# EAGLE design dcdc_0421 (EAGLE 9.6.2)
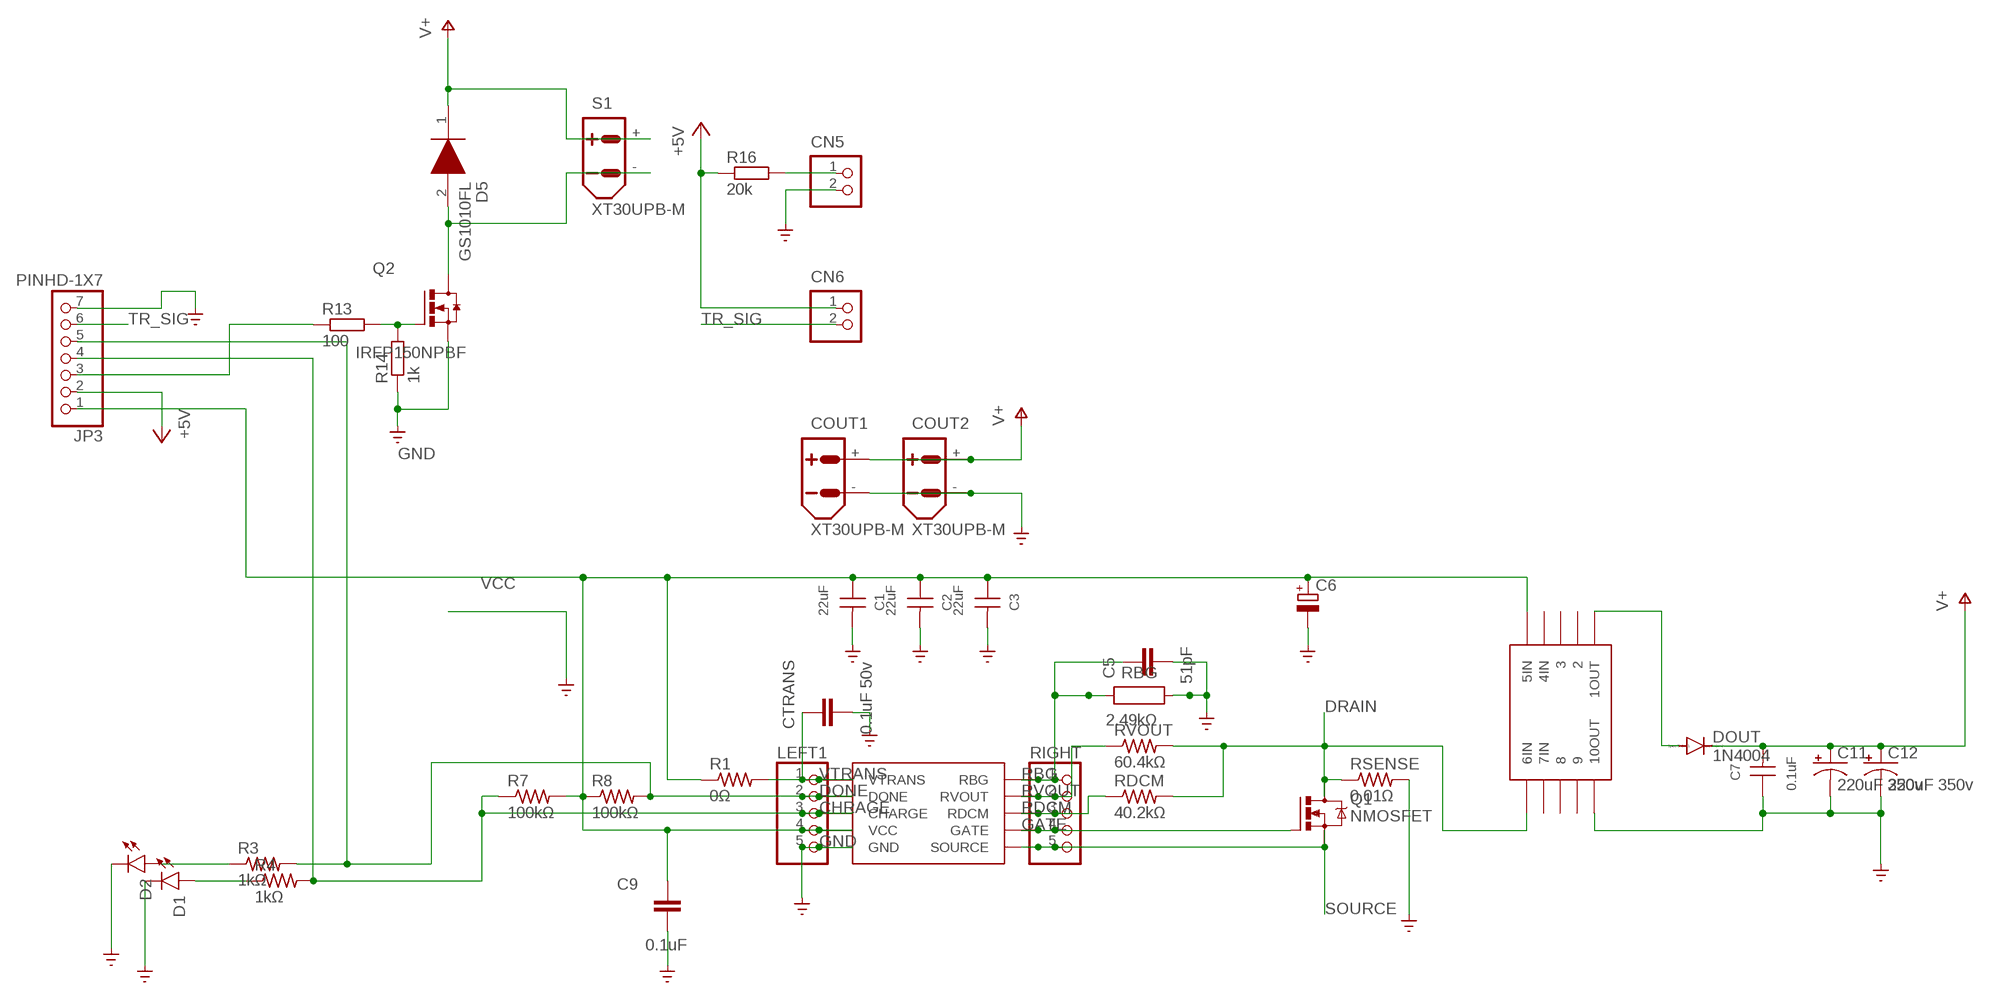
[diagram p0: schematic, sheet 1]

## Parts
C1  22uF  WCAP-CSGP_1210_H0.95_885012009002_25V(DC)  [WCAP-CSGP_1210_H0.95]
C2  22uF  WCAP-CSGP_1210_H0.95_885012009002_25V(DC)  [WCAP-CSGP_1210_H0.95]
C3  22uF  WCAP-CSGP_1210_H0.95_885012009002_25V(DC)  [WCAP-CSGP_1210_H0.95]
C5  51pF  C0603C100C5GACTU  [CAP_0603]
C6  CPOL-EUTT2D6  [TT2D6]
C7  0.1uF  WCAP-CSGP_1812_H1.25_885012010001_16V(DC)  [WCAP-CSGP_1812_H1.25]
C9  0.1uF  C0603C100C5GACTU  [CAP_0603]
C11  220uF 350v  CAPACITOR-PE7.5-18  [E7,5-18]
C12  220uF 350v  CAPACITOR-PE7.5-18  [E7,5-18]
CN5  S2B-XH-A  [S2B-XH-A]
CN6  S2B-XH-A  [S2B-XH-A]
COUT1  XT30UPB-M  [XT30UPB-M]
COUT2  XT30UPB-M  [XT30UPB-M]
CTRANS  0.1uF 50v  GRM31CR60J107ME39L  [CAP_1206]
D1  LED_RADIALWHITE  [LEDRD254W60D565H860B_W]
D2  LED_RADIALWHITE  [LEDRD254W60D565H860B_W]
D5  GS1010FL  [SODFL3618X110N]
DOUT  1N4004  [DO41-10]
JP3  PINHD-1X7  [1X07]
LEFT1  PINHD-1X5  [1X05]
Q1  NMOSFET  NMOSFET__TO220  [TO220BV]
Q2  IRFP150NPBF  [TO-247AC]
R1  0Ω  R-US_M2012  [M2012]
R3  1kΩ  RC0402JR-070RL  [RES_0402]
R4  1kΩ  RC0402JR-070RL  [RES_0402]
R7  100kΩ  R-US_R1210  [R1210]
R8  100kΩ  R-US_R1210  [R1210]
R13  100  R-EU_R0603  [R0603]
R14  1k  R-EU_R0603  [R0603]
R16  20k  R-EU_R0603  [R0603]
RBG  2.49kΩ  WRIS-PSMC_2512_580070763005_6.3X3.1X0.51X1.1  [WRIS_PSMC_2512_6.3X3.1X0.51X1.1(LXWXHXPW)]
RDCM  40.2kΩ  CRCW08050000Z0EA  [RES_0805]
RIGHT  PINHD-1X5  [1X05]
RSENSE  0.01Ω  WSLP1206R0500FEA  [RES_1206]
RVOUT  60.4kΩ  CRCW08050000Z0EA  [RES_0805]
S1  XT30UPB-M  [XT30UPB-M]
U$1  LT3750_2  [LT3750_2]
U$2  32052  [32052]

## Nets
2 [New Class]: D5.2(A) Q2.D S1.-
+5V [New Class]: CN6.1 JP3.2 R16.1
CHRAGE: JP3.4 LEFT1.3 R4.2 R7.1 U$1.CHARGE
DONE: JP3.5 LEFT1.2 R3.2 R8.2 U$1.DONE
DRAIN [New Class]: Q1.D RDCM.2 RSENSE.1 RVOUT.2 U$2.6IN
GATE: Q1.G RIGHT.4 U$1.GATE
GND: C1.2 C2.2 C3.2 C5.2 C6.- C7.1 C9.2 C11.- C12.- CN5.2 COUT1.- COUT2.- CTRANS.2 D1.C D2.C JP3.7 LEFT1.5 Q2.S R14.1 RBG.2 RSENSE.2 U$1.GND U$2.10OUT ; supply symbol labelled SUPPLY0_GND_
N$1 [New Class]: JP3.3 R13.1
N$7 [New Class]: DOUT.A U$2.1OUT
N$11 [New Class]: D1.A R4.1
N$15 [New Class]: D2.A R3.1
N$21 [New Class]: Q2.G R13.2 R14.2
N$22 [New Class]: CN5.1 R16.2
RBG: C5.1 RBG.1 RIGHT.1 U$1.RBG
RDCM: RDCM.1 RIGHT.3 U$1.RDCM
RVOUT: RIGHT.2 RVOUT.1 U$1.RVOUT
SOURCE: Q1.S RIGHT.5 U$1.SOURCE
TR_SIG [New Class]: CN6.2 JP3.6
V+ [New Class]: C7.2 C11.+ C12.+ COUT1.+ COUT2.+ D5.1(K) DOUT.C S1.+
VCC: C1.1 C2.1 C3.1 C6.+ C9.1 JP3.1 LEFT1.4 R1.1 R7.2 R8.1 U$1.VCC U$2.5IN
VTRANS: CTRANS.1 LEFT1.1 R1.2 U$1.VTRANS
Unconnected: U$2.2 U$2.3 U$2.4IN U$2.7IN U$2.8 U$2.9

## Library data of the parts
C1-C3 = Wurth_Capacitors_WCAP-CSGP:WCAP-CSGP_1210_H0.95: WCAP-CSGP MLCCs 1210 Characteristics General purpose product series High performance ceramic High electrical precision and stability ceramic especially for NP0 Minimal aging especially for NP0 Mounting style: SMT-Chip Ceramic: NP0 (Class I), X5R (Class II), X7R (Class II) Temperature coefficient: ±30 ppm/°C; ±0.54 % for NP0 ±15 % for X5R and X7R Operating temperature: -55 °C up to + 125 °C for NP0 and X7R -55 °C up to + 85 °C for X5R Termination: Cu/Ni/Sn Recommended soldering: Reflow soldering Wave soldering for size 0603 Wave soldering for size 0805 (only valid for the thickness ≤0.85 mm) Applications Temperature compensation (NP0) Coupling Decoupling Bypass Smoothing Filtering Resonant circuit <https://www.we-online.com/catalog/media/o177837v209%20MLCC_GRP_all.jpg> Details see: https://www.we-online.com/catalog/en/pbs/capacitors/multilayer_ceramic_chip_capacitors/mlcc_general_purpose Updated by yingchun,Shan;2020-03-09 2020(C) Würth Elektronik; CERAMIC-TYPE: NP0 Class I; DATASHEET-URL: https://www.we-online.com/redexpert/spec/885012009002?ae; DF: -; HEIGHT: 0.95mm; MOUNT: SMT; OPERATING-TEMPERATURE: -55 up to +125 °C; PART-NUMBER: 885012009002; QMIN: 1000; RISO: 10GOhm; SIZE: 1210; TECHNICAL-REFERENCE: NP01210102J025DFCT10000; VALUE: 1nF; VR: 25V(DC)
C5 C9 = Resistor_Capacitor:C0603C100C5GACTU: CAP CER 10PF 50V C0G/NP0 0603 Manufacturer's datasheet <https://content.kemet.com/datasheets/KEM_C1003_C0G_SMD.pdf>; CREATED_BY: PCBLayout.com; DIGIKEY_PART_NUMBER: 399-7814-2-ND; MANUFACTURER: KEMET; MPN: C0603C100C5GACTU; PACKAGE: SMD 0603
C6 = rcl:CPOL-EU: POLARIZED CAPACITOR, European symbol; SPICEPREFIX: C
C7 = Wurth_Capacitors_WCAP-CSGP:WCAP-CSGP_1812_H1.25: WCAP-CSGP MLCCs 1812 Characteristics General purpose product series High performance ceramic High electrical precision and stability ceramic especially for NP0 Minimal aging especially for NP0 Mounting style: SMT-Chip Ceramic: NP0 (Class I), X5R (Class II), X7R (Class II) Temperature coefficient: ±30 ppm/°C; ±0.54 % for NP0 ±15 % for X5R and X7R Operating temperature: -55 °C up to + 125 °C for NP0 and X7R -55 °C up to + 85 °C for X5R Termination: Cu/Ni/Sn Recommended soldering: Reflow soldering Wave soldering for size 0603 Wave soldering for size 0805 (only valid for the thickness ≤0.85 mm) Applications Temperature compensation (NP0) Coupling Decoupling Bypass Smoothing Filtering Resonant circuit <https://www.we-online.com/catalog/media/o177837v209%20MLCC_GRP_all.jpg> Details see: https://www.we-online.com/catalog/en/pbs/capacitors/multilayer_ceramic_chip_capacitors/mlcc_general_purpose Updated by yingchun,Shan;2020-03-09 2020(C) Würth Elektronik; CERAMIC-TYPE: NP0 Class I; DATASHEET-URL: https://www.we-online.com/redexpert/spec/885012010001?ae; DF: -; HEIGHT: 1.25mm; MOUNT: SMT; OPERATING-TEMPERATURE: -55 up to +125 °C; PART-NUMBER: 885012010001; QMIN: 1000; RISO: 10GOhm; SIZE: 1812; TECHNICAL-REFERENCE: NP01812102J016DFCT10000; VALUE: 1nF; VR: 16V(DC)
C11 C12 = BeagleBone_Blue_R3:CAPACITOR-P: POLARIZED CAPACITOR, American symbol
CN5 CN6 = jst-xh:S2B-XH-A: Wire-to-Board 2.5mm pitch side mount connector Source: http://www.jst-mfg.com/product/pdf/jpn/XH.pdf http://www.jst-mfg.com/product/detail.php?series=277
COUT1 COUT2 S1 = amass:XT30: AMASS XT30 connector Store in Japan AMASS XT30 connector <https://szc.jp/ams-xt30>
CTRANS = Resistor_Capacitor:GRM31CR60J107ME39L: CAP CER 100UF 6.3V X5R 1206 Manufacturer's datasheet <https://www.murata.com/~/media/webrenewal/support/library/catalog/products/capacitor/mlcc/c02e.ashx?la=en-us>; CREATED_BY: PCBLayout.com; DIGIKEY_PART_NUMBER: GRM31CR60J107ME39L; MANUFACTURER: Murata Electronics North America; MPN: GRM31CR60J107ME39L; PACKAGE: SMD 1206
D1 D2 = Opto-Electronic:LED_RADIAL: LED - Generic
D5 = GS1010FL:GS1010FL: Surface general purpose rectifier Source: Datasheet; DESCRIPTION: Surface general purpose rectifier; HEIGHT: 1.1mm; MANUFACTURER_NAME: PANJIT; MANUFACTURER_PART_NUMBER: GS1010FL
DOUT = diode:1N4004: DIODE general purpose rectifier, 1 A
JP3 = Connector:PINHD-1X7: PIN HEADER; CATEGORY: CONNECTOR; SUB-CATEGORY: PIN-HEADER
LEFT1 RIGHT = Connector:PINHD-1X5: PIN HEADER; CATEGORY: CONNECTOR; SUB-CATEGORY: PIN-HEADER
Q1 = Tinkercad:NMOSFET: N-Channel MOSFET - Generic; CATEGORY: Transistor; SUB-CATEGORY: MOSFET; TYPE: N-Channel
Q2 = Transistor:IRFP150NPBF: MOSFET N-CH 100V 42A TO247AC Manufacturer's datasheet <https://www.infineon.com/dgdl/irfp150npbf.pdf?fileId=5546d462533600a4015356286d121fd6>; CREATED_BY: PCBLayout.com; DIGIKEY_PART_NUMBER: IRFP150NPBF-ND; MANUFATURER: Infineon Technologies; MPN: IRFP150NPBF; PACKAGE: TO-247AC
R1 R7 R8 = BeagleBone_Black_Wireless:R-US_: RESISTOR, American symbol
R3 R4 = Resistor_Capacitor:RC0402JR-070RL: RES SMD 0 OHM JUMPER 1/16W 0402 Manufacturer's datasheet <http://www.yageo.com/documents/recent/PYu-RC_Group_51_RoHS_L_10.pdf>; CREATED_BY: PCBLayout.com; DIGIKEY_PART_NUMBER: 311-0.0JRTR-ND; MANUFACTURER: Yageo; MPN: RC0402JR-070RL; PACKAGE: SMD 0402
R13 R14 R16 = rcl:R-EU_: RESISTOR, European symbol; SPICEPREFIX: R
RBG = Wurth_Resistor_WRIS-PSMC:WRIS-PSMC_2512: WRIS-PSMC Metal Plate Resistors High Power Current Sensing Characteristics Product series for high power current sensing up to 2 W Mounting style: SMT-Chip (standard terminal) Resistance range: 2 mΩ ‒ 10 mΩ Resistance tolerance: ±1%; ±5% Rated Power: 2 W TCR: ±100 ppm/°C Operating temperature: -55°C up to +155°C Size: 2512 Recommended soldering: Reflow soldering Applications Ignition coil & igniter Motor control Inverter Battery pack Package name and Variant abbreviation: L X W X H X PW =Length X Width X Height X Pad Width <https://katalog.we-online.com/media/images/v2/o135744v209%20Family_WRIS-PSMC.jpg> Details see: https://katalog.we-online.com/en/pbs/WRIS-PSMC Created by Ella Wu 2019-09-05 2019(C) Wurth Elektronik; DATASHEET-URL: https://katalog.we-online.de/pbs/datasheet/580070763005.pdf; IR: 20A; MOUNT: SMT; PART-NUMBER: 580070763005; PRATED: 2W; TCR: ±100ppm/ °C; TECHNICAL-REFERENCE: MC2512R005F201KAATE0000; VALUE: 5mOhm
RDCM RVOUT = Resistor_Capacitor:CRCW08050000Z0EA: RES SMD 0 OHM JUMPER 1/8W 0805 Manufacturer's datasheet <http://www.vishay.com/docs/20035/dcrcwe3.pdf>; CREATED_BY: PCBLayout.com; DIGIKEY_PART_NUMBER: 541-0.0ATR-ND; MANUFACTURER: Vishay Dale; MPN: CRCW08050000Z0EA; PACKAGE: SMD 0805
RSENSE = Resistor_Capacitor:WSLP1206R0500FEA: RES 0.05 OHM 1% 1W 1206 Manufacturer's datasheet <http://www.vishay.com/docs/30122/wslp.pdf>; CREATED_BY: PCBLayout.com; DIGIKEY_PART_NUMBER: WSLP-.05TR-ND; MANUFACTURER: Vishay Dale; MPN: WSLP1206R0500FEA; PACKAGE: SMD 1206
U$1 = boostTest1215:LT3750_2
U$2 = boostTest1215:32052

## Net classes
0 default: width 0.2 mm, drill 0.1 mm
1 New Class: width 1.2 mm, clearance 0.203 mm

## Board
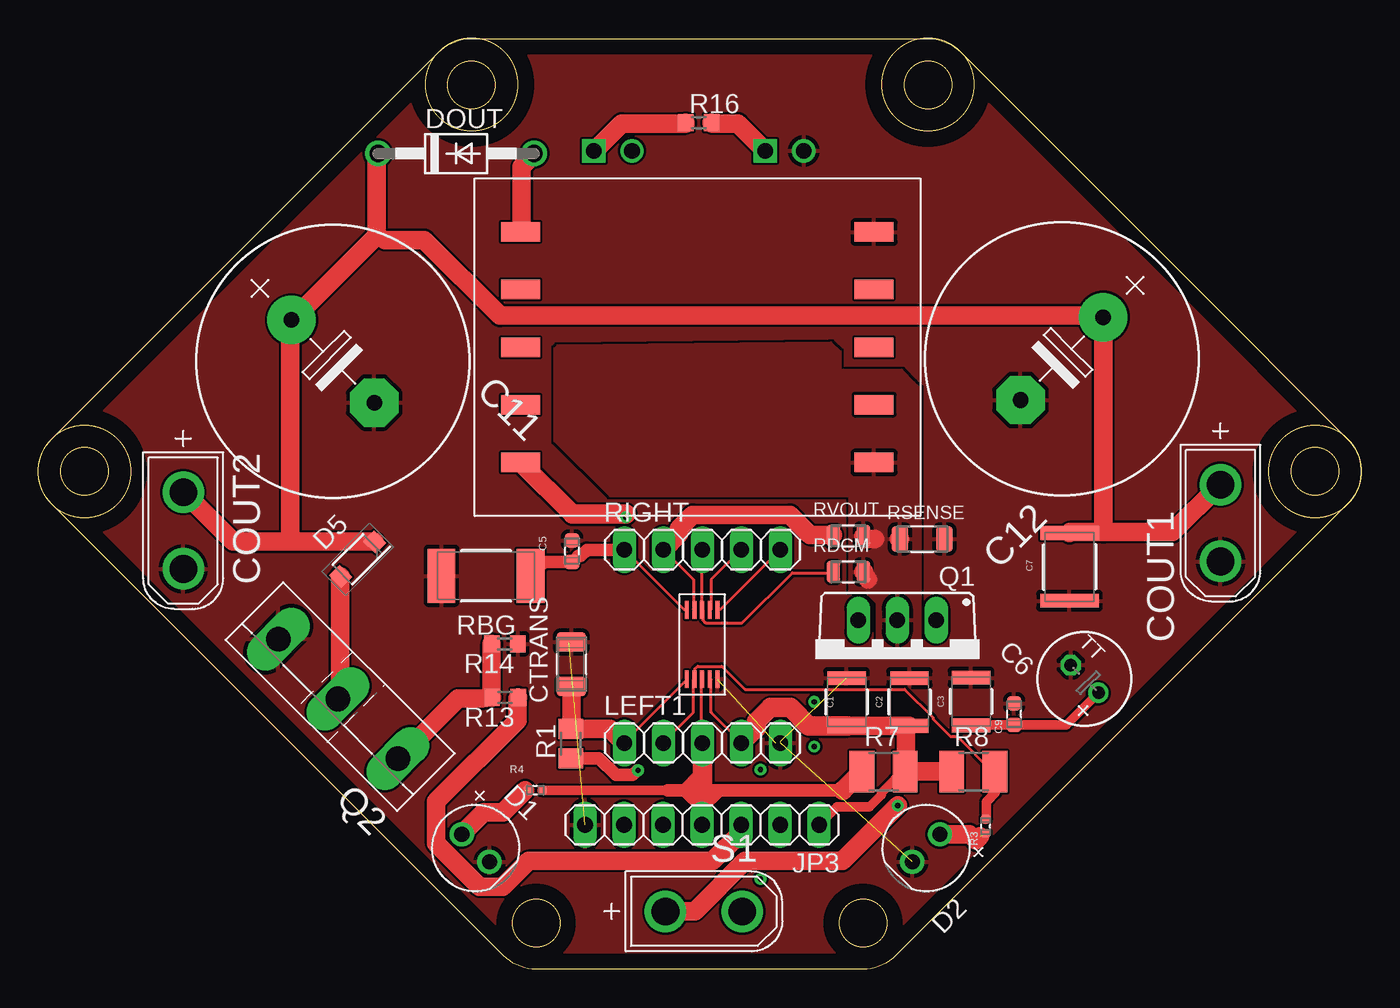
[diagram p1: board, top side]
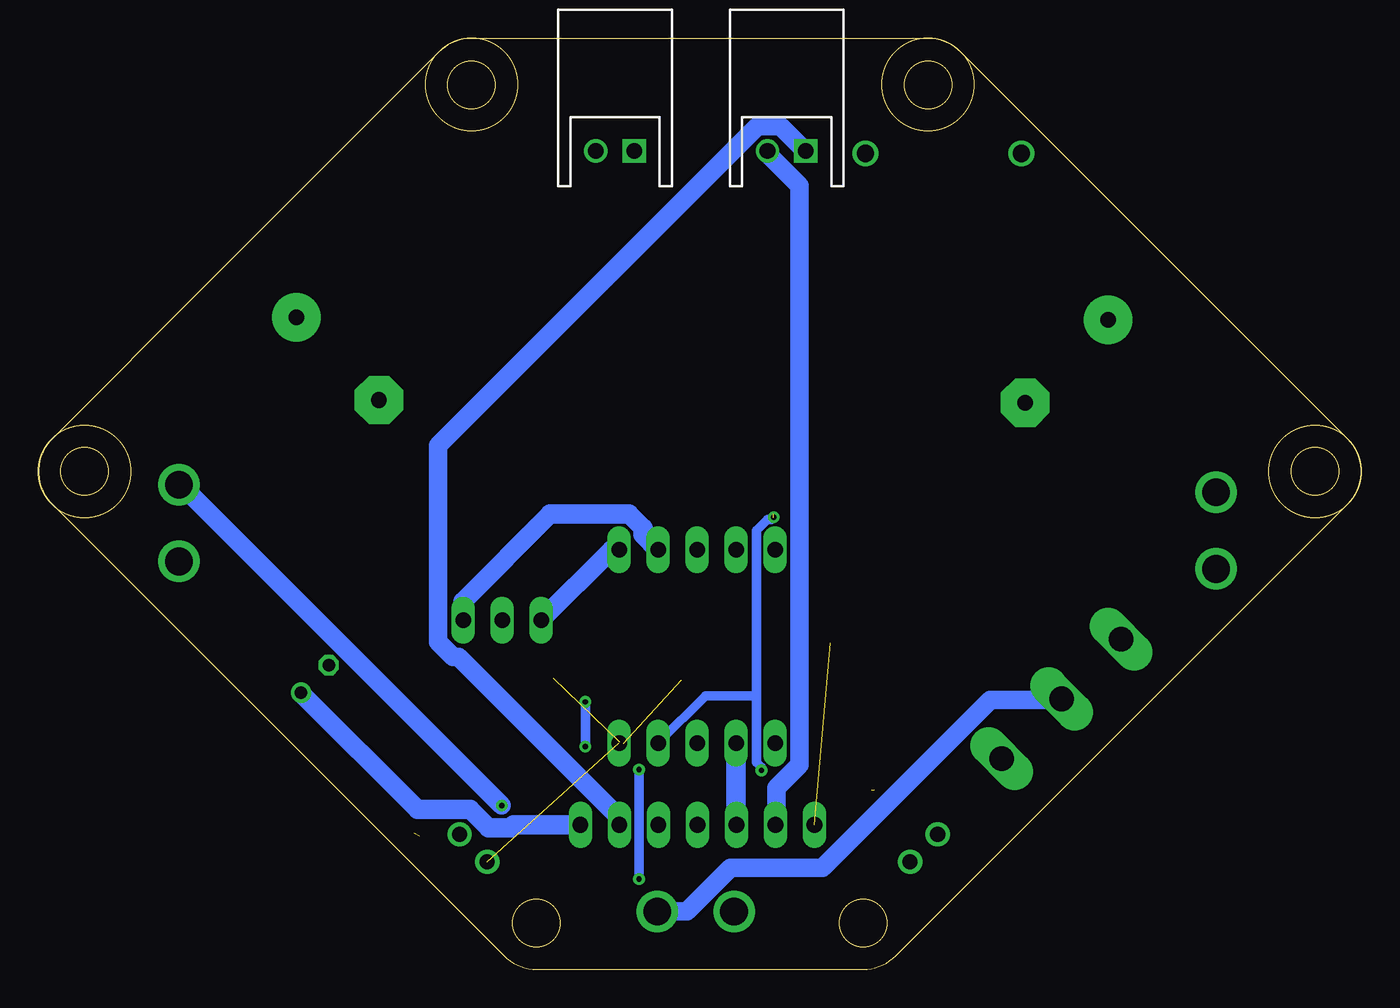
[diagram p2: board, bottom side, seen from below]

Size 86.1 x 60.6 mm. Coordinates in mm from the lower left corner, seen from the top.
Outline: 0.88,30.29 arc-90 0.88,34.53
Outline: 26.05,59.7 arc-45 28.17,60.58
Outline: 57.92,60.58 arc-45 60.04,59.7
Outline: 85.21,34.53 arc-90 85.21,30.29
Outline: 0.88,34.53 26.05,59.7
Outline: 26.05,59.7 arc-45 28.17,60.58
Outline: 28.17,60.58 57.92,60.58
Outline: 57.92,60.58 arc-45 60.04,59.7
Outline: 60.04,59.7 74.91,44.83 85.21,34.53
Outline: 85.21,34.53 arc-90 85.21,30.29
Outline: 85.21,30.29 55.8,0.88 arc-45 53.68,0 32.41,0 arc-45 30.29,0.88 0.88,30.29
Outline: 0.88,30.29 arc-90 0.88,34.53
Outline: circle at 28.17,57.58 radius 1.55
Outline: circle at 57.92,57.58 radius 1.55
Outline: circle at 83.09,32.41 radius 1.55
Outline: circle at 3,32.41 radius 1.55
Outline: circle at 28.2,57.6 radius 3
Outline: circle at 57.9,57.6 radius 3
Outline: circle at 3,32.4 radius 3
Outline: circle at 83.1,32.4 radius 3
Outline: circle at 28.17,57.58 radius 1.55
Outline: circle at 57.92,57.58 radius 1.55
Outline: circle at 83.09,32.41 radius 1.55
Outline: circle at 53.68,3 radius 1.55
Outline: circle at 32.41,3 radius 1.55
Outline: circle at 3,32.41 radius 1.55
Copper layers (1*16): Top 0.035mm / dielectric 1.5mm / Bottom 0.035mm
Design rules "default": minimum track width 6mil, minimum drill 0.35mm, track to track 6mil, track to pad 6mil, pad to pad 6mil, via to via 6mil, smd to smd 6mil, copper to edge 40mil, drill to drill 6mil, minimum pad ring 10mil, minimum via ring 8mil, stop-mask expansion 4mil, vias tented up to drill 0mil, thermal gap 10mil

### Footprints (pad centres in the part's own frame; a part is rotated, then mirrored left to right if it is on the bottom)
WCAP-CSGP_1210_H0.95 = smd 0.9 x 2.5: 1 -1.55,0; 2 1.55,0
CAP_0603 = smd 0.92 x 0.93: 1 -0.705,0; 2 0.705,0
TT2D6 = drill 0.813: + -1.27,0 | drill 0.813 octagon: - 1.27,0
WCAP-CSGP_1812_H1.25 = smd 0.9 x 3.8: 1 -2.2,0; 2 2.2,0
E7,5-18 = drill 1.016 pad 3.15: + -3.81,0 | drill 1.016 pad 3.15 octagon: - 3.81,0
S2B-XH-A = drill 1.016 square: 1 1.25,0 | drill 1.016: 2 -1.25,0
XT30UPB-M = drill 1.8: + 2.5,0; - -2.5,0
CAP_1206 = smd 1.29 x 1.91: 1 -1.46,0; 2 1.46,0
LEDRD254W60D565H860B_W = drill 0.981 pad 1.581: A -1.27,0; C 1.27,0
SODFL3618X110N = smd 1 x 1.13: 1 -1.575,0; 2 1.575,0
DO41-10 = drill 1.118: A 5.08,0; C -5.08,0
1X07 = drill 1.016 long: 1 -7.62,0; 2 -5.08,0; 3 -2.54,0; 4 0,0; 5 2.54,0; 6 5.08,0; 7 7.62,0
1X05 = drill 1.016 long: 1 -5.08,0; 2 -2.54,0; 3 0,0; 4 2.54,0; 5 5.08,0
TO220BV = drill 1.016 long: D 0,-2.54; G -2.54,-2.54; S 2.54,-2.54
TO-247AC = drill 1.6 long: D 0,0; G -5.5,0; S 5.5,0
M2012 = smd 1.3 x 1.6: 1 -0.95,0; 2 0.95,0
RES_0402 = smd 0.58 x 0.58: 1 -0.46,0; 2 0.46,0
R1210 = smd 1.6 x 2.7: 1 -1.4,0; 2 1.4,0
R0603 = smd 1 x 1.1: 1 -0.85,0; 2 0.85,0
WRIS_PSMC_2512_6.3X3.1X0.51X1.1(LXWXHXPW) = smd 1.8 x 3.5: 1 -2.9,0; 2 2.9,0
RES_0805 = smd 0.87 x 1.42: 1 -0.975,0; 2 0.975,0
RES_1206 = smd 1.08 x 1.68: 1 -1.445,0; 2 1.445,0
LT3750_2 = smd 1.15 x 0.25: CHARGE 0.5,1.5; DONE 0.5,2; GATE 5,1; GND 0.5,0.5; RBG 5,2.5; RDCM 5,1.5; RVOUT 5,2; SOURCE 5,0.5; VCC 0.5,1; VTRANS 0.5,2.5
32052 = smd 2.54 x 1.27: 1OUT 3,18.5; 2 3,14.75; 3 3,11; 4IN 3,7.25; 5IN 3,3.5; 6IN 26,3.5; 7IN 26,7.25; 8 26,11; 9 26,14.75; 10OUT 26,18.5

### Placement (x,y rotation side)
C1  52.61,17.4 90 top
C2  56.7,17.4 90 top
C3  60.71,17.43 90 top
C5  34.74,27.22 90 top
C6  68.1,18.9 135 top
C7  67.12,26.19 90 top
C9  63.51,16.61 90 top
C11  19.17,39.58 315 top
C12  66.62,39.75 225 top
CN5  48.57,53.28 0 bottom
CN6  37.39,53.28 0 bottom
COUT1  76.95,29.05 90 top
COUT2  9.43,28.56 90 top
CTRANS  34.7,19.86 90 top
D1  28.46,7.89 315 top
D2  57.78,7.89 225 top
D5  20.78,26.69 225 top
DOUT  27.19,53.11 0 top
JP3  43.2,9.4 180 top
LEFT1  43.22,14.73 0 top
Q1  55.91,20.19 180 top
Q2  19.5,17.6 135 top
R1  34.66,14.69 90 top
R3  61.66,9.31 90 top
R4  32.34,11.66 0 top
R7  55.01,12.88 0 top
R8  60.86,12.87 0 top
R13  30.38,17.7 180 top
R14  30.36,21.19 180 top
R16  42.98,55.1 0 top
RBG  29.14,25.61 180 top
RDCM  52.72,25.87 0 top
RIGHT  43.22,27.31 0 top
RSENSE  57.53,28.01 0 top
RVOUT  52.72,28.21 0 top
S1  43.32,3.76 180 top
U$1  44.7,18.39 90 top
U$2  28.4,29.5 0 top

### Tracks (layer width: path | path; a pad name or v marks a point on that pad's centre or on a via)
2
  Top 1.2: D5.2 19.65,25.54 19.65,17.7 19.56,17.61 Q2.D
  Bottom 1.2: S1.- 45.81,3.78 43.87,3.78 41.05,6.6 35.06,6.6 24.14,17.53 19.56,17.53 Q2.D
+5V
  Top 1.2: R16.1 42.11,55.06 37.97,55.06 36.21,53.3 CN6.1
  Bottom 1.2: JP3.2 48.37,9.42 48.37,9.95 58.76,20.35 59.12,20.35 60.08,21.32 60.08,34.09 39.29,54.88 37.8,54.88 36.21,53.3 CN6.1
CHRAGE
  Top 0.2: 32.86,11.62 R4.2 | 43.17,9.42 JP3.4 | U$1.CHARGE 43.17,18.85 43.17,14.8 LEFT1.3 43.26,14.71 | 53.56,12.86 53.57,12.86 R7.1
  Top 0.61: R4.2 40.94,11.66 | 43.22,9.42 43.19,9.42 43.18,9.41 JP3.4 43.2,10.36 44.5,11.66 | 43.19,10.3 43.19,10.37 41.9,11.66 43.04,12.8 43.22,12.8
  Top 0.813: 40.94,11.66 41.9,11.66 43.2,11.66 44.5,11.66 52.37,11.66
  Top 1.27: 52.37,11.66 53.57,12.86 | LEFT1.3 43.22,12.8 43.22,11.68 43.2,11.66 43.19,11.65 43.19,10.3 43.19,9.42
DONE
  Top 0.2: 61.67,12.33 62.2,12.86 R8.2 62.11,12.86 59.82,15.15 59.38,15.15 58.23,16.29 58.23,16.38 56.38,18.23 45.99,18.23 44.49,19.73 42.91,19.73 42.73,19.55 42.73,18.94 U$1.DONE 42.64,18.85 42.64,16.73 40.7,14.8 LEFT1.2 | R3.2
  Top 0.61: R3.2 61.7,9.81 61.7,10.9 62.3,11.5 62.3,12.76 62.2,12.86
  Bottom 0.2: 40.7,9.42 JP3.5 | 40.7,14.71 LEFT1.2
  Bottom 1.27: LEFT1.2 40.68,9.44 40.7,9.42
DRAIN
  Top 1.2: 53.74,25.9 RDCM.2 54.01,25.37 | RVOUT.2 53.74,28.19 53.74,28.01 54.45,28.01 | 56.03,28.01 RSENSE.1 | 54.45,32.95 U$2.6IN | 55.85,23.52 55.85,22.81 Q1.D
  pour Top (rank 2): 57.2,21 54.6,21 54.6,23.8 54,24.4 53.8,24.6 52.8,24.6 52.8,30.8 37.2,30.8 33.6,34.4 33.6,40.4 33.8,40.6 51.6,40.8 52.2,40.2 52.2,39.2 52.2,39 56.2,39 57,38.2 57.2,38 57.4,37.8 57.4,21
GATE
  Top 0.2: U$1.GATE 43.79,23.43 43.79,25.37 45.72,27.31 RIGHT.4
  Bottom 1.27: RIGHT.4 46.75,28.3 46.75,28.71 47.66,29.62 52.78,29.62 58.45,23.95 Q1.G
GND  (4 unrouted)
  Top 0.2: 44.23,18.85 U$1.GND | 48.28,14.8 LEFT1.5 | 35.5,9.33 JP3.7 | 29.43,7.04 D1.C | 34.53,21.23 34.62,21.32 CTRANS.2 34.8,21.32 | 31.28,21.23 R14.1 31.28,21.32 | 34.71,27.92 C5.2 | 26.25,25.63 RBG.2 26.17,25.63 | 54.36,48.01 U$2.10OUT | 52.68,19.02 C1.2 52.6,19.02 | 56.65,19.02 C2.2 56.74,19.02 | 63.43,17.35 C9.2 63.52,17.35 | 60.79,18.94 C3.2 | 59.03,27.92 RSENSE.2 59.03,28.1 | 60.7,19.02 C3.2 | 60.61,19.02 C3.2 | 67.13,19.82 C6.- 67.04,19.82 | 67.13,23.96 C7.1 67.22,23.96
  Bottom 0.2: 48.01,14.71 48.28,14.71 LEFT1.5 | 67.13,19.73 C6.-
  pour Top (rank 6): -10,77 -10,-3 90,-3 90,77
N$1
  Top 1.2: R13.1 31.19,17.61 31.19,16.21 25.9,10.92 25.9,8.19 28.72,5.37 30.22,5.37 31.89,7.04 43.87,7.04 45.72,8.89 45.72,9.33 JP3.3
N$2  (via drill 0.35)
  Bottom 0.61: v47,13 47,10.7 47.01,10.69 47.01,8.11 47,8.1 v47,5.86
N$3  (via drill 0.35)
  Bottom 0.61: v50.5,17.4 v50.5,14.5
N$7
  Top 1.2: U$2.1OUT 31.45,48.01 31.45,52.24 32.24,53.03 DOUT.A
N$11  (1 unrouted)
  Top 1.2: D1.A 28.97,10.2 30.23,10.2 31.69,11.66
N$15  (1 unrouted)
  Top 1.2: D2.A 60.61,8.79 61.02,8.38 61.3,8.66
N$21
  Top 1.2: 29.51,17.7 29.51,21.14 R14.2 | 29.51,17.7 R13.2 | 29.51,17.7 28.9,17.61 27.31,17.61 23.43,13.74 Q2.G
N$22
  Top 1.2: R16.2 43.87,55.06 45.55,55.06 47.31,53.3 CN5.1
RBG
  Top 0.2: 34.71,26.51 C5.1 34.8,26.6 | 32.07,25.63 RBG.1 | U$1.RBG 42.2,23.43 42.02,23.43 RIGHT.1 38.06,27.31
  Top 0.813: RBG.1 32.95,26.52 C5.1 35.13,26.91 35.3,26.91 35.7,27.31 38.06,27.31
RDCM
  Top 0.2: RIGHT.3 43.17,27.31 43.17,23.43 U$1.RDCM 43.26,23.34 43.26,22.73 43.43,22.55 45.81,22.55 49.07,25.81 51.72,25.81 RDCM.1
RVOUT
  Top 0.2: U$1.RVOUT 42.64,23.43 42.64,25.37 40.7,27.31 RIGHT.2 40.88,27.22 | 51.72,28.28 RVOUT.1
  Top 1.2: RIGHT.2 41.71,28.34 41.71,28.7 42.59,29.59 48.93,29.59 50.24,28.28 51.72,28.28
SOURCE
  Top 0.2: U$1.SOURCE 44.23,23.43 44.4,23.43 48.28,27.31 RIGHT.5
  Bottom 1.27: RIGHT.5 48.79,27.31 Q1.S
TR_SIG
  Bottom 1.2: JP3.6 38.06,9.42 38.06,11.8 36.56,13.3 36.56,51.01 38.59,53.03 38.59,53.21 CN6.2
V+  (via drill 0.35)
  Top 1.2: 16.39,27.84 12.69,27.84 9.52,31.01 COUT2.+ | 16.39,27.84 21.85,27.84 D5.1 | 22.02,47.75 22.02,53.03 DOUT.C | 22.02,47.75 16.56,42.28 C11.+ 16.39,41.67 16.39,27.84 | 69.33,28.45 73.83,28.45 76.91,31.53 COUT1.+ | 69.33,28.45 67.13,28.45 C7.2 | v55.94,10.65 52.33,7.04 45.99,7.04 42.73,3.78 40.88,3.78 S1.+ | 69.33,28.45 69.33,42.37 C12.+ 68.72,42.55 30.04,42.55 25.11,47.48 22.55,47.48 22.02,47.75
  Bottom 1.2: v55.94,10.65 76.91,31.62 COUT1.+
VCC  (via drill 0.35)  (1 unrouted)
  Top 0.2: 63.43,15.94 C9.1 63.52,15.94 63.7,15.94 | 60.79,15.94 C3.1 | 68.98,17.97 C6.+ | 52.68,15.85 C1.1 52.6,15.77 51.54,15.77 | 56.65,15.85 C2.1 56.6,15.81 56.47,15.77 | 56.47,13.1 56.47,12.95 R7.2 | 59.38,12.95 R8.1 | 56.56,12.95 56.46,12.9 R7.2 | 50.83,9.42 JP3.1 | 56.38,12.86 R7.2 | U$1.VCC 43.79,18.85 43.79,16.73 45.72,14.8 LEFT1.4 45.81,14.71 | 34.71,13.74 R1.1 | 31.45,32.95 U$2.5IN
  Top 0.61: JP3.1 51.99,10.57 54.09,10.57 54.87,11.34 54.87,11.49 56.47,13.1 | C3.1 60.73,15.91 C9.1 66.9,15.91 C6.+
  Top 0.813: R1.1 36.5,13.74 37.59,12.65 38.69,12.65 38.99,12.95 v39.03,12.95
  Top 1.2: C1.1 56.56,15.85 56.6,15.81 | C2.1 56.46,15.61 56.46,12.9 | R7.2 59.31,12.88 59.38,12.95
  Top 1.27: LEFT1.4 46.75,15.72 46.75,16.13 47.66,17.04 48.94,17.04 50.13,15.85 52.68,15.85 | U$2.5IN 34.78,29.62 38.23,29.62
  Bottom 0.2: 68.98,17.53 68.98,17.97 C6.+ | 50.83,9.33 JP3.1 | 45.72,14.8 LEFT1.4
  Bottom 0.61: v39.03,12.95 39.03,13.13 39.36,13.46 39.36,17.8 | v38.23,29.42 38.37,29.29 38.65,29.29 39.36,28.58 39.36,17.8 | LEFT1.4 42.69,17.8 39.36,17.8
  Bottom 1.27: JP3.1 55.16,9.4 55.35,9.22 56.8,9.22 58,10.42 61.43,10.42 68.98,17.97
VTRANS
  Top 0.2: 34.71,15.68 R1.2 34.8,15.68 | 34.71,18.32 CTRANS.1 | U$1.VTRANS 42.2,18.85 38.15,14.8 LEFT1.1 38.06,14.8
  Top 1.2: CTRANS.1 34.7,15.69 34.71,15.68 | R1.2 37.22,15.64 38.06,14.8